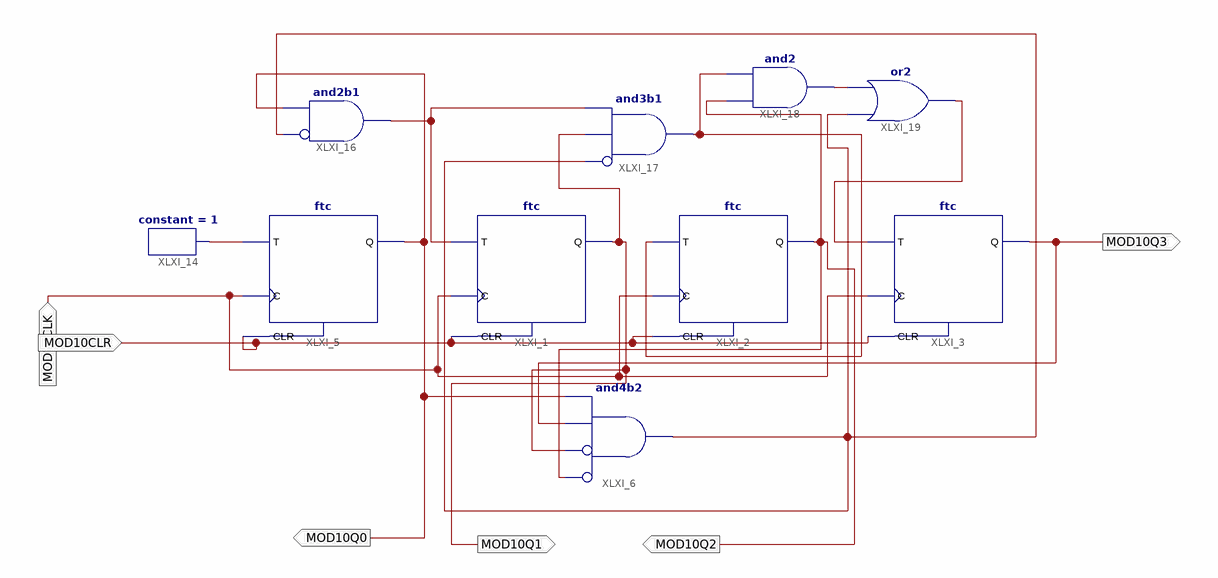
[diagram p0: schematic sheet 1]
// Xilinx ISE schematic MOD10COUNTER.sch (spartan6) as structural Verilog: 10 symbols, 6 ports
module MOD10COUNTER (
  input  MOD10CLK,
  input  MOD10CLR,
  output MOD10Q3,
  output MOD10Q0,
  output MOD10Q1,
  output MOD10Q2
);

  wire XLXN_19, XLXN_39, XLXN_45, XLXN_50, XLXN_51, XLXN_56;

  ftc XLXI_1 (.C(MOD10CLK), .CLR(MOD10CLR), .T(XLXN_45), .Q(MOD10Q1));
  ftc XLXI_2 (.C(MOD10CLK), .CLR(MOD10CLR), .T(XLXN_51), .Q(MOD10Q2));
  ftc XLXI_3 (.C(MOD10CLK), .CLR(MOD10CLR), .T(XLXN_19), .Q(MOD10Q3));
  ftc XLXI_5 (.C(MOD10CLK), .CLR(MOD10CLR), .T(XLXN_39), .Q(MOD10Q0));
  and XLXI_6 (XLXN_56, ~MOD10Q2, ~MOD10Q1, MOD10Q3, MOD10Q0);  // and4b2
  constant #(.CValue("1")) XLXI_14 (.O(XLXN_39));
  and XLXI_16 (XLXN_45, ~XLXN_56, MOD10Q0);  // and2b1
  and XLXI_17 (XLXN_51, ~XLXN_56, MOD10Q1, XLXN_45);  // and3b1
  and XLXI_18 (XLXN_50, MOD10Q2, XLXN_51);
  or XLXI_19 (XLXN_19, XLXN_56, XLXN_50);
endmodule
